# EAGLE schematic 4550 design_bkp (EAGLE 5.08)
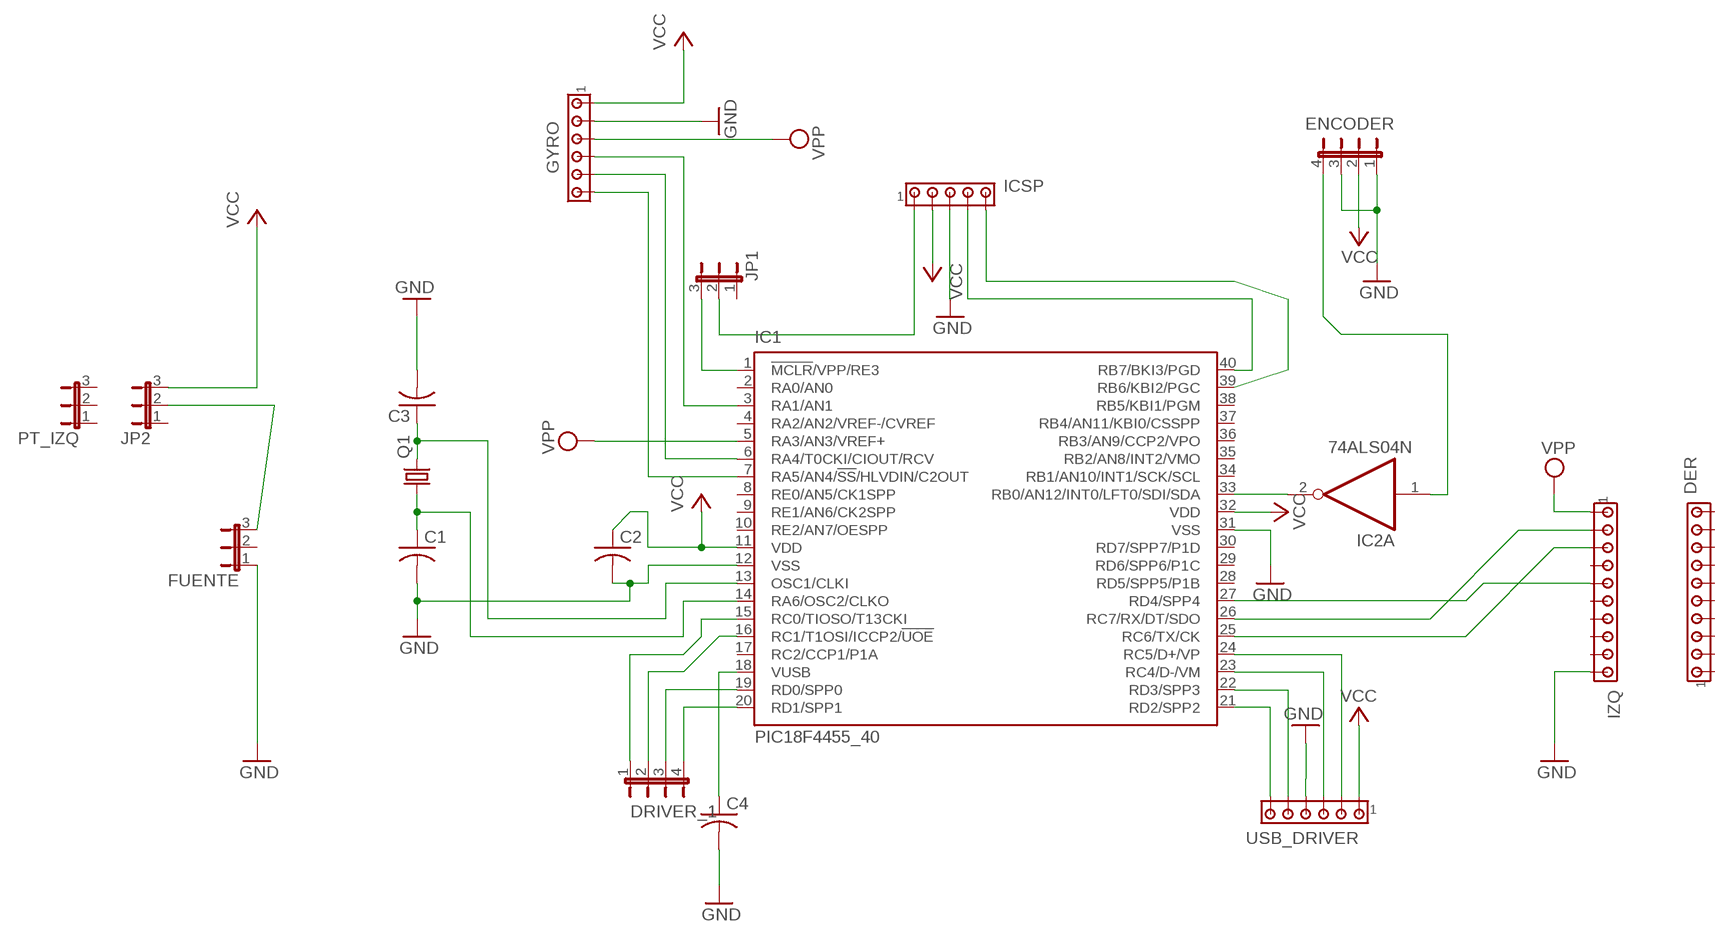
[diagram p0: schematic, sheet 1]

## Parts
C1  C-US025-024X044  [C025-024X044]
C2  C-US025-024X044  [C025-024X044]
C3  C-US025-024X044  [C025-024X044]
C4  C-US025-024X044  [C025-024X044]
DER  MTA10-100  [10X10MTA]
DRIVER_1  JP4E  [JP4]
ENCODER  JP4E  [JP4]
FUENTE  JP2E  [JP2]
GYRO  MTA06-100  [10X06MTA]
IC1  PIC18F4455_40  [DIL40]
IC2  74ALS04N  [DIL14]
ICSP  MTA05-100  [10X05MTA]
IZQ  MTA10-100  [10X10MTA]
JP1  JP2E  [JP2]
JP2  JP2E  [JP2]
PT_IZQ  JP2E  [JP2]
Q1  CRYSTALHC49S  [HC49/S]
USB_DRIVER  MTA06-100  [10X06MTA]

## Nets
N$2: C3.1 IC1.13(OSC1/CLKI) Q1.2
N$3: C1.1 IC1.14(RA6/OSC2/CLKO) Q1.1
N$4: IC1.33(RB0/AN12/INT0/LFT0/SDI/SDA) IC2.2(A:O)
N$5: ENCODER.4 IC2.1(A:I)
N$7: GYRO.3 IC1.3(RA1/AN1)
N$8: GYRO.2 IC1.6(RA4/T0CKI/CIOUT/RCV)
N$9: GYRO.1 IC1.7(RA5/AN4/!SS!/HLVDIN/C2OUT)
N$10: IC1.1(!MCLR!/VPP/RE3) JP1.3
N$11: ICSP.1 JP1.2
N$12: IC1.40(RB7/BKI3/PGD) ICSP.4
N$13: IC1.39(RB6/KBI2/PGC) ICSP.5
N$16: DRIVER_1.1 IC1.15(RC0/TIOSO/T13CKI)
N$17: DRIVER_1.2 IC1.16(RC1/T1OSI/ICCP2/!UOE)
N$18: DRIVER_1.3 IC1.19(RD0/SPP0)
N$19: DRIVER_1.4 IC1.20(RD1/SPP1)
N$20: C4.1 IC1.18(VUSB)
N$21: IC1.21(RD2/SPP2) USB_DRIVER.1
N$22: IC1.22(RD3/SPP3) USB_DRIVER.2
N$23: IC1.23(RC4/D-/VM) USB_DRIVER.4
N$24: IC1.24(RC5/D+/VP) USB_DRIVER.5
N$32: C1.2 C2.2 C3.2 C4.2 ENCODER.1 ENCODER.3 FUENTE.1 GYRO.5 IC1.12(VSS) IC1.31(VSS) ICSP.3 IZQ.10 USB_DRIVER.3 ; supply symbol labelled GND
N$35: FUENTE.3 JP2.2
N$39: IC1.26(RC7/RX/DT/SDO) IZQ.2
N$40: IC1.25(RC6/TX/CK) IZQ.3
N$42: IC1.27(RD4/SPP4) IZQ.5
N$43: C2.1 ENCODER.2 GYRO.6 IC1.11(VDD) IC1.32(VDD) ICSP.2 JP2.3 USB_DRIVER.6 ; supply symbol labelled VCC
N$47: GYRO.4 IC1.5(RA3/AN3/VREF+) IZQ.1 ; supply symbol labelled VPP
Unconnected: DER.1 DER.2 DER.3 DER.4 DER.5 DER.6 DER.7 DER.8 DER.9 DER.10 FUENTE.2 IC1.2(RA0/AN0) IC1.4(RA2/AN2/VREF-/CVREF) IC1.8(RE0/AN5/CK1SPP) IC1.9(RE1/AN6/CK2SPP) IC1.10(RE2/AN7/OESPP) IC1.17(RC2/CCP1/P1A) IC1.28(RD5/SPP5/P1B) IC1.29(RD6/SPP6/P1C) IC1.30(RD7/SPP7/P1D) IC1.34(RB1/AN10/INT1/SCK/SCL) IC1.35(RB2/AN8/INT2/VMO) IC1.36(RB3/AN9/CCP2/VPO) IC1.37(RB4/AN11/KBI0/CSSPP) IC1.38(RB5/KBI1/PGM) IC2.3(B:I) IC2.4(B:O) IC2.5(C:I) IC2.6(C:O) IC2.8(D:O) IC2.9(D:I) IC2.10(E:O) IC2.11(E:I) IC2.12(F:O) IC2.13(F:I) IZQ.4 IZQ.6 IZQ.7 IZQ.8 IZQ.9 JP1.1 JP2.1 PT_IZQ.1 PT_IZQ.2 PT_IZQ.3

## Power pins joined to a net without a drawn wire
GND: IC2.7(P:GND)
VCC: IC2.14(P:VCC)

## Library data of the parts
C1-C4 = rcl:C-US: CAPACITOR, American symbol
DER IZQ = con-amp:MTA10-100: AMP connector
DRIVER_1 ENCODER = jumper:JP4E: JUMPER
FUENTE JP1 JP2 PT_IZQ = jumper:JP2E: JUMPER
GYRO USB_DRIVER = con-amp:MTA06-100: AMP connector
IC1 = microchip:PIC18F4*_40: USB Microcontrollers with nanoWatt Technology High-Performance, Enhanced Flash, 28/40/44-Pin, Source: http://ww1.microchip.com/downloads/en/devicedoc/39632c.pdf
IC2 = 74xx-eu:74*04: Hex INVERTER
ICSP = con-amp:MTA05-100: AMP connector
Q1 = crystal:CRYSTAL: CRYSTAL